# Altium schematic sheet 1_P1.schdoc.schdoc
size 309 x 223 mm; Symbol: Sheet-Symbol_A3; Device: Sheet-Symbol_A3; Company: 嘉立创EDA; Version: V1.0; Page Size: A3; @Project Name: WotageiStick; @Page Count: 1; @Update Date: 2024-01-03; @Create Date: 2023-12-16; @Schematic Name: Schematic1; @Page No: 1; @Page Name: P1
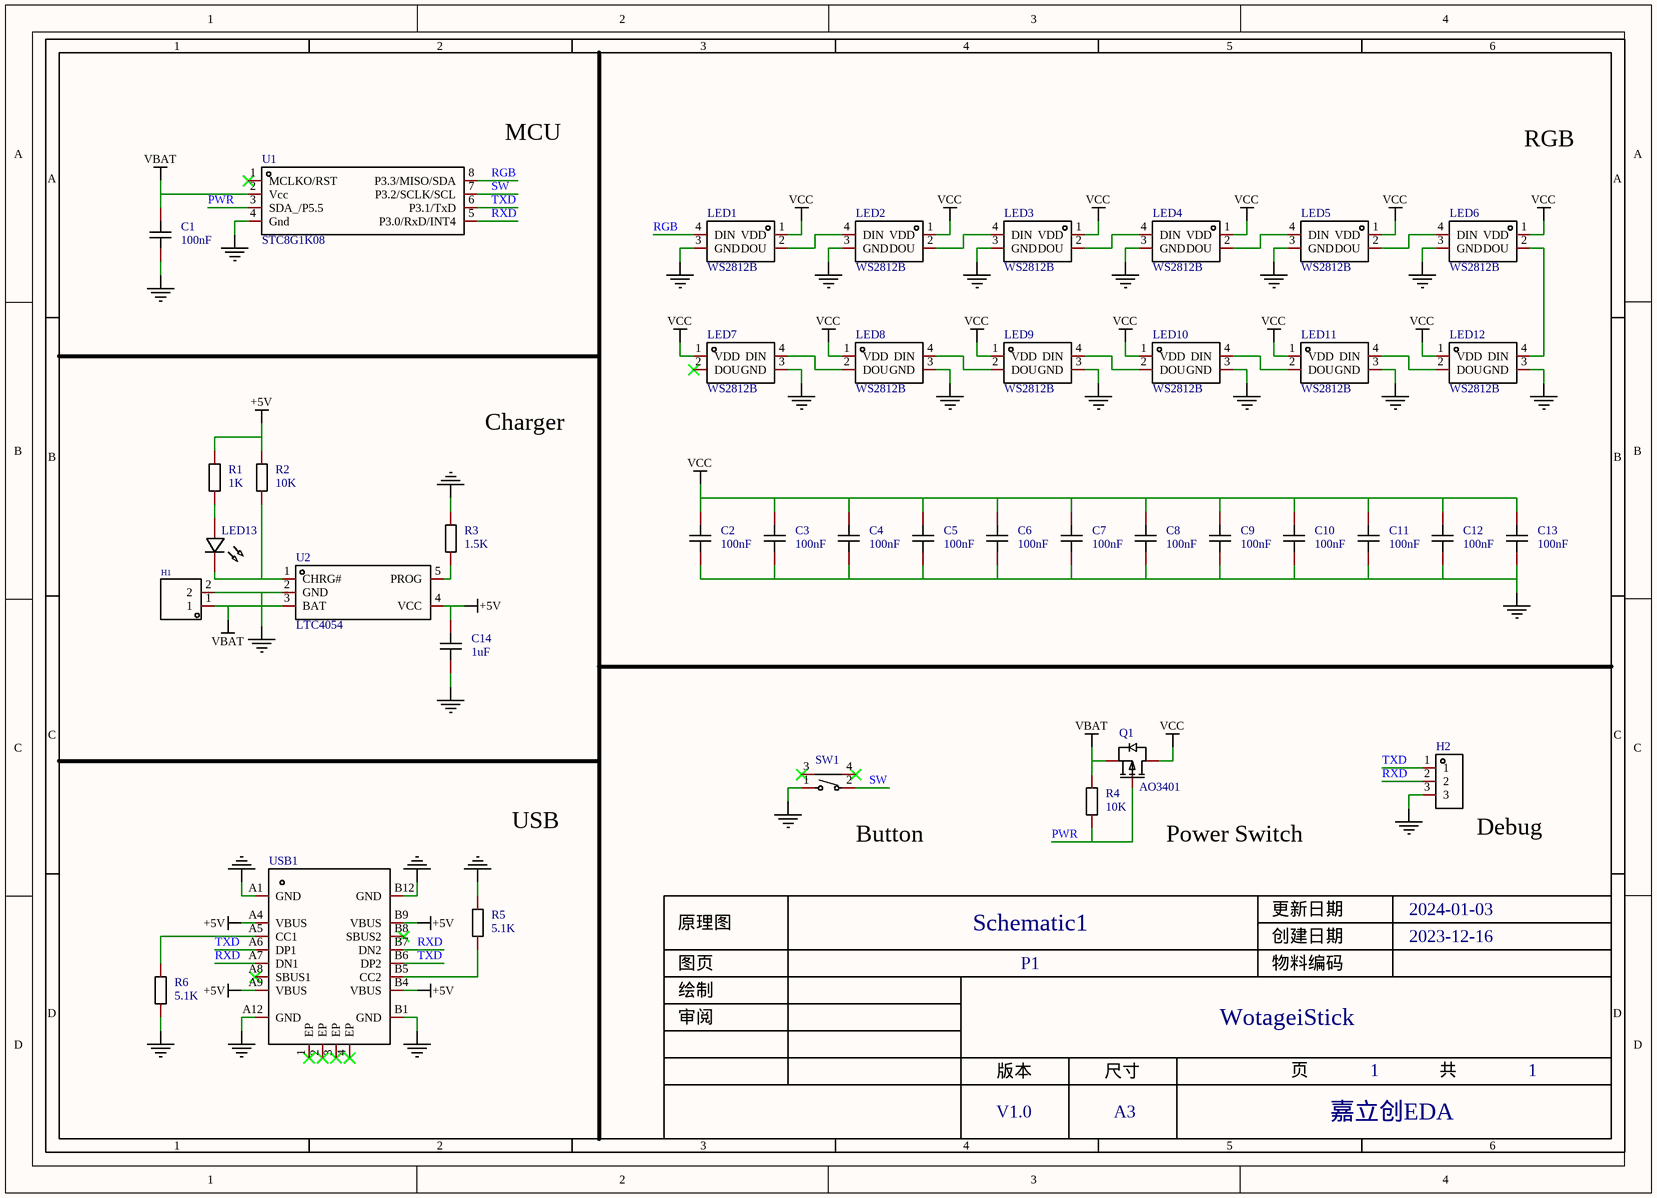
[diagram p0: 1_P1.schdoc.schdoc]

## Parts
C1  100nF  [C0603]
C2  100nF  [C0603]
C3  100nF  [C0603]
C4  100nF  [C0603]
C5  100nF  [C0603]
C6  100nF  [C0603]
C7  100nF  [C0603]
C8  100nF  [C0603]
C9  100nF  [C0603]
C10  100nF  [C0603]
C11  100nF  [C0603]
C12  100nF  [C0603]
C13  100nF  [C0603]
C14  1uF  [C0603]
H1  HDR-M_2.54_1x2P  [HDR-TH_2P-P2.54-V-M-1]  (value not drawn)
H2  HDR-M_2.54_1x3P  [HDR-TH_3P-P2.54-V-M]  (value not drawn)
LED1  WS2812B  [LED-SMD_4P-L5.0-W5.0-BL_XL-5050RGBC]
LED2  WS2812B  [LED-SMD_4P-L5.0-W5.0-BL_XL-5050RGBC]
LED3  WS2812B  [LED-SMD_4P-L5.0-W5.0-BL_XL-5050RGBC]
LED4  WS2812B  [LED-SMD_4P-L5.0-W5.0-BL_XL-5050RGBC]
LED5  WS2812B  [LED-SMD_4P-L5.0-W5.0-BL_XL-5050RGBC]
LED6  WS2812B  [LED-SMD_4P-L5.0-W5.0-BL_XL-5050RGBC]
LED7  WS2812B  [LED-SMD_4P-L5.0-W5.0-BL_XL-5050RGBC]
LED8  WS2812B  [LED-SMD_4P-L5.0-W5.0-BL_XL-5050RGBC]
LED9  WS2812B  [LED-SMD_4P-L5.0-W5.0-BL_XL-5050RGBC]
LED10  WS2812B  [LED-SMD_4P-L5.0-W5.0-BL_XL-5050RGBC]
LED11  WS2812B  [LED-SMD_4P-L5.0-W5.0-BL_XL-5050RGBC]
LED12  WS2812B  [LED-SMD_4P-L5.0-W5.0-BL_XL-5050RGBC]
LED13  LED_0603-R  [LED_0603]  (value not drawn)
Q1  AO3401  [AO3401A_SOT-23-3]
R1  1K  [R0603]
R2  10K  [R0603]
R3  1.5K  [R0603]
R4  10K  [R0603]
R5  5.1K  [R0603]
R6  5.1K  [R0603]
SW1  TS-KG86E-ACT35F  [SW-SMD_TS-KG86EV-ART35]  (value not drawn)
U1  STC8G1K08  [SOP-8_L5.0-W4.0-P1.27-LS6.0-BL]
U2  LTC4054  [SOT-23-5_L3.0-W1.7-P0.95-LS2.8-BL]
USB1  USB_TYPE-C-16P  [USB_TYPE-C-16P]  (value not drawn)

## Nets
+5V: C14.2 R1.1 R2.1 U2.4(VCC) USB1.A4(VBUS) USB1.A9(VBUS) USB1.B4(VBUS) USB1.B9(VBUS)
NetC1_1: C1.1 C2.1 C3.1 C4.1 C5.1 C6.1 C7.1 C8.1 C9.1 C10.1 C11.1 C12.1 C13.1 C14.1 H1.2 H2.3 LED1.3(GND) LED2.3(GND) LED3.3(GND) LED4.3(GND) LED5.3(GND) LED6.3(GND) LED7.3(GND) LED8.3(GND) LED9.3(GND) LED10.3(GND) LED11.3(GND) LED12.3(GND) R3.1 R5.1 R6.1 SW1.1 U1.4(Gnd) U2.2(GND) USB1.A1(GND) USB1.A12(GND) USB1.B1(GND) USB1.B12(GND)
VBAT: C1.2 H1.1 Q1.2(S) R4.2 U1.2(Vcc) U2.3(BAT)
VCC: C2.2 C3.2 C4.2 C5.2 C6.2 C7.2 C8.2 C9.2 C10.2 C11.2 C12.2 C13.2 LED1.1(VDD) LED2.1(VDD) LED3.1(VDD) LED4.1(VDD) LED5.1(VDD) LED6.1(VDD) LED7.1(VDD) LED8.1(VDD) LED9.1(VDD) LED10.1(VDD) LED11.1(VDD) LED12.1(VDD) Q1.3(D)
PWR: Q1.1(G) R4.1 U1.3(SDA_/P5.5)
RGB: LED1.4(DIN) U1.8(P3.3/MISO/SDA)
RXD: H2.2 U1.5(P3.0/RxD/INT4) USB1.A7(DN1) USB1.B7(DN2)
SW: SW1.2 U1.7(P3.2/SCLK/SCL)
TXD: H2.1 U1.6(P3.1/TxD) USB1.A6(DP1) USB1.B6(DP2)
NetLED1_2: LED1.2(DOU) LED2.4(DIN)
NetLED2_2: LED2.2(DOU) LED3.4(DIN)
NetLED3_2: LED3.2(DOU) LED4.4(DIN)
NetLED4_2: LED4.2(DOU) LED5.4(DIN)
NetLED5_2: LED5.2(DOU) LED6.4(DIN)
NetLED6_2: LED6.2(DOU) LED12.4(DIN)
NetLED7_4: LED7.4(DIN) LED8.2(DOU)
NetLED8_4: LED8.4(DIN) LED9.2(DOU)
NetLED9_4: LED9.4(DIN) LED10.2(DOU)
NetLED10_4: LED10.4(DIN) LED11.2(DOU)
NetLED11_4: LED11.4(DIN) LED12.2(DOU)
NetLED13_1: LED13.1(C) R2.2 U2.1(CHRG#)
NetLED13_2: LED13.2(A) R1.2
NetR3_2: R3.2 U2.5(PROG)
NetR5_2: R5.2 USB1.B5(CC2)
NetR6_2: R6.2 USB1.A5(CC1)

Not connected (* = marked no-connect by the designer): LED7 2(DOU)*; SW1 3* 4*; U1 1(MCLKO/RST)*; USB1 1(EP)* 2(EP)* 3(EP)* 4(EP)* A8(SBUS1)* B8(SBUS2)*

## Notes on the sheet
- (near U1) MCU
- RGB
- Charger
- USB
- (near SW1) Button
- Power Switch
- (near H2) Debug
- 1
- 2
- 3
- 4
- 5
- 6
- A
- B
- C
- 原理图
- Schematic1
- 创建日期
- 更新日期
- 2024-01-03
- 2023-12-16
- D
- 审阅
- 绘制
- 图页
- P1
- 物料编码
- WotageiStick
- 版本
- 尺寸
- 页
- 共
- V1.0
- A3
- 嘉立创EDA

## Library data of the parts
C1-C14 = CAP_0603: Symbol: CapAcitance; Convert to PCB: yes; Device: CAP_0603; Add into BOM: yes; Supplier Footprint: 0603
  C1-C13: Name: 100nF; Value: 100nF
  C14: Name: 1uF; Value: 1uF
H1 = HDR-M_2.54_1x2P: Manufacturer: Ckmtw(灿科盟); Manufacturer Part: B-2100S02P-A110; Symbol: 210S-1*2P L=11.6MMGold-plated black; Convert to PCB: yes; Device: HDR-M_2.54_1x2P; Supplier: LCSC; Supplier Part: C124375; JLCPCB Part Class: Extended Part; Add into BOM: yes; Supplier Footprint: 插件
H2 = HDR-M_2.54_1x3P: Symbol: PZ254V-11-03P_C2937625; Convert to PCB: yes; Device: HDR-M_2.54_1x3P; Add into BOM: yes; Supplier Part: C2937625; Supplier Footprint: 插件
LED1-LED12 = XL-5050RGBC-WS2812B: Manufacturer: XINGLIGHT(成兴光); Add into BOM: yes; Emitted Color: RGB三色; Lens Color: 无色透明透镜; Peak Wavelength: 625nm；470nm；530nm; Viewing Angle: 120°; Mounting Sytle: 正贴; Description: 发光颜色:RGB三色;二极管配置:-;功率:-;透镜颜色:无色透明透镜;主波长:-;色温:-;发光角度:120°;安装方式:正贴;工作温度:-30℃~+70℃;; Name: WS2812B; Symbol: XL-5050RGBC-WS2812B; Device: XL-5050RGBC-WS2812B; Supplier: LCSC; Supplier Part: C2843785; Manufacturer Part: WS2812B; JLCPCB Part Class: 扩展库; LCSC Part Name: RGB三色 正贴 幻彩; Supplier Footprint: SMD5050; Datasheet: https://atta.szlcsc.com/upload/public/pdf/source/20230111/86AAD2096485A2E5BCAB883FF8CBE6FD.pdf; Convert to PCB: yes; Diode Configuration: -; Forward Current: -; Power Dissipation: -; Dominant Wavelength: -; Color Temperature: -; Operating Temperature: -30℃~+70℃
LED13 = LED_0603-R: Symbol: LED_R; Convert to PCB: yes; Device: LED_0603-R; Add into BOM: yes; Supplier Footprint: 0603
Q1 = AO3401A_P: Symbol: P_MOS; Add into BOM: yes; Name: AO3401; Device: AO3401A_P; Supplier Footprint: SOT-23-3L; Convert to PCB: yes; Supplier Part: C15127
R1-R6 = Res_0603: Symbol: 电阻; Convert to PCB: yes; Device: Res_0603; Add into BOM: yes; Supplier Footprint: 0603
  R1: Name: 1K; Value: 1K
  R2 R4: Name: 10K; Value: 10K
  R3: Name: 1.5K; Value: 1.5K
  R5 R6: Name: 5.1K; Value: 5.1K
SW1 = TS-KG86E-ACT35F: Manufacturer: HANBO(汉博); Add into BOM: yes; Contact Current: 50mA; Voltage Rating (DC): 12V; Insulation Resistance: 100MΩ; Description: 触点电流:50mA;额定电压(DC):12V;绝缘电阻:100MΩ;机械寿命:-;; Symbol: TS-KG86E-ACT35F; Device: TS-KG86E-ACT35F; Supplier: LCSC; Supplier Part: C2874419; Manufacturer Part: TS-KG86E-ACT35F; JLCPCB Part Class: 扩展库; LCSC Part Name: 侧按轻触开关2*4*3.5 迷你小型贴片按键开关; Supplier Footprint: -; Datasheet: https://atta.szlcsc.com/upload/public/pdf/source/20221110/7C8A71DCCE0191ED5ADB1ED6693AEFDE.pdf; Convert to PCB: yes; Mechanical Life: -
U1 = STC8G1K08-36I-SOP8: Manufacturer: STC(宏晶); Add into BOM: yes; CPU Core: 51系列; Program Storage Size: 8KB; Program Memory Type: FLASH; GPIO Ports Number: 6; Operating Voltage Range: 1.9V~5.5V; RAM Size: 1.25KB; 16Bit Timer: 2; UART/USART: 1; Peripheral/Function: 低电压检测；看门狗；除法器；乘法器; Watchdog: 有; Description: CPU内核:51系列;CPU最大主频:-;程序存储容量:8KB;程序存储器类型:FLASH;GPIO端口数量:6;工作电压范围:1.9V~5.5V;RAM总容量:1.25KB;; Name: STC8G1K08; Symbol: STC8G1K08-36I-SOP8; Device: STC8G1K08-36I-SOP8; Supplier: LCSC; Supplier Part: C713818; Manufacturer Part: STC8G1K08; JLCPCB Part Class: 扩展库; LCSC Part Name: STC8G1K08-36I-SOP8; Supplier Footprint: SOP-8; Datasheet: https://atta.szlcsc.com/upload/public/pdf/source/20230914/7707908C45C6343AE73767C1466DDB8D.pdf; Convert to PCB: yes; CPU Maximum Speed: -; EEPROM: -; Operating Temperature Range: -40℃~+85℃; ADC (Bit): -; DAC (Bit): -; PWM (Bit): -; 8Bit Timer: -; 32Bit Timer: -; CAN: -; I2C: 1; I2S: -; SPI: 1; Universal Serial Bus: -; Internal Comparator: -; communication protocol: -; Real-Time Clock: -; Infrared Data Association: -; Low-Voltage Detect: 有; CCP Capture/Compare: -; Secure Digital Input and Output: -; Direct Memory Access: -; Internal Oscillator: 有
U2 = LTC4054ES5-4.2#PBF: Manufacturer: ADI(亚德诺)/LINEAR(凌特); Add into BOM: yes; Description: 具有热调节功能的独立线性锂离子电池充电器; Name: LTC4054; Symbol: LTC4054ES5-4.2#PBF; Device: LTC4054ES5-4.2#PBF; LCSC Part Name: LTC4054ES5-4.2#PBF; Supplier Part: C117064; Manufacturer Part: LTC4054; Supplier Footprint: SOT-23-5; JLCPCB Part Class: 扩展库; Datasheet: https://atta.szlcsc.com/upload/public/pdf/source/20170712/C117064_1499832277334814248.pdf; Supplier: LCSC; Convert to PCB: yes
USB1 = USB_TYPE-C-16P: Add into BOM: yes; Symbol: USB_TYPE-C-16P; Device: USB_TYPE-C-16P; Supplier Footprint: SMD; Convert to PCB: yes